# EAGLE schematic Pro Trinket Keyboard V2 (EAGLE 7.1.0)
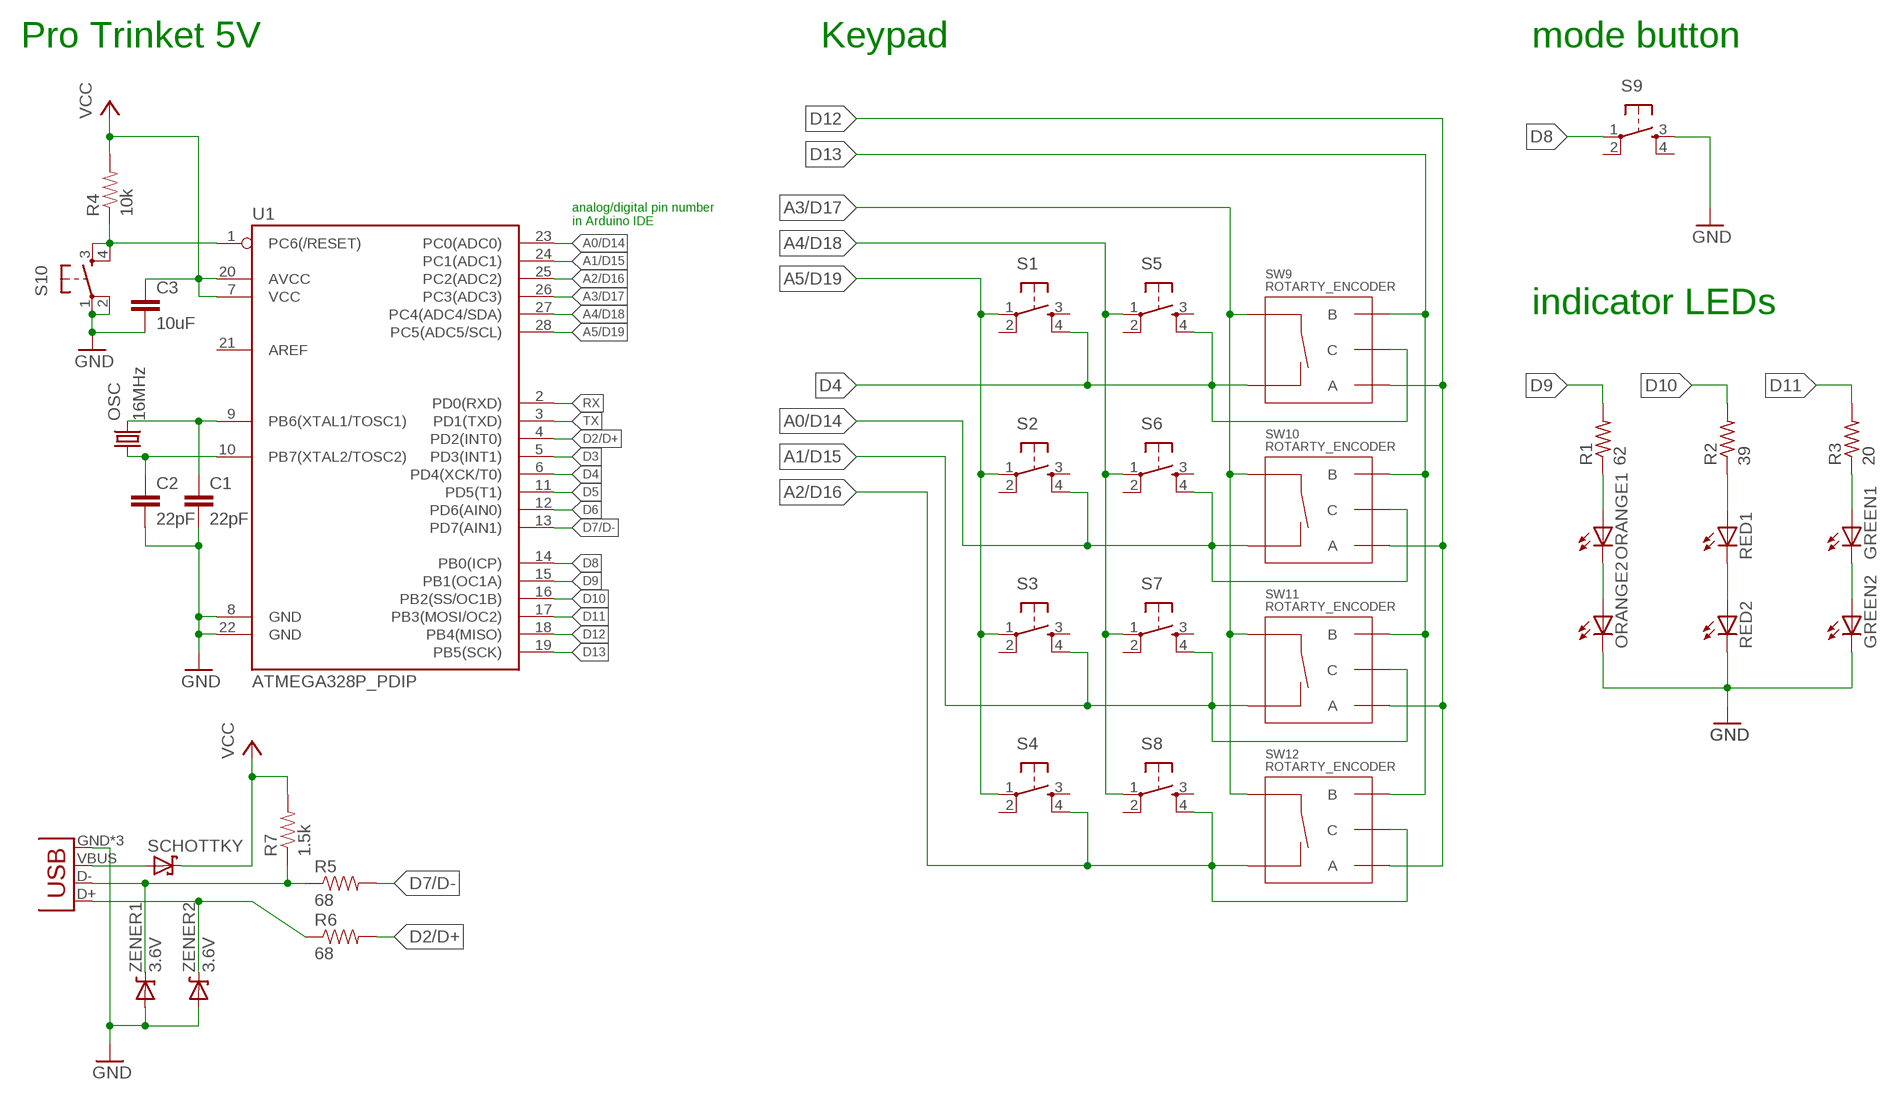
[diagram p0: schematic, sheet 1]

## Parts
C1  22pF  22PF-50V-5%(0603)  [0603-CAP]
C2  22pF  22PF-50V-5%(0603)  [0603-CAP]
C3  10uF  10UF-6.3V-20%(0603)  [0603-CAP]
GREEN1  LED3MM  [LED3MM]
GREEN2  LED3MM  [LED3MM]
JP1  USB-MICROB  [USB-MICROB]
ORANGE1  LED3MM  [LED3MM]
ORANGE2  LED3MM  [LED3MM]
OSC  16MHz  CRYSTALHC49S  [HC49/S]
R1  62  R-US_0204/7  [0204/7]
R2  39  R-US_0204/7  [0204/7]
R3  20  R-US_0204/7  [0204/7]
R4  10k  RESISTOR0805-RES  [0805]
R5  68  RESISTOR0805-RES  [0805]
R6  68  RESISTOR0805-RES  [0805]
R7  1.5k  RESISTOR0805-RES  [0805]
RED1  LED3MM  [LED3MM]
RED2  LED3MM  [LED3MM]
S1  TAC_SWITCHPTH  [TACTILE-PTH]
S2  TAC_SWITCHPTH  [TACTILE-PTH]
S3  TAC_SWITCHPTH  [TACTILE-PTH]
S4  TAC_SWITCHPTH  [TACTILE-PTH]
S5  TAC_SWITCHPTH  [TACTILE-PTH]
S6  TAC_SWITCHPTH  [TACTILE-PTH]
S7  TAC_SWITCHPTH  [TACTILE-PTH]
S8  TAC_SWITCHPTH  [TACTILE-PTH]
S9  TAC_SWITCHPTH  [TACTILE-PTH]
S10  TAC_SWITCHPTH  [TACTILE-PTH]
SCHOTTKY  SCHOTTKY-DIODEAG  [AG]
SW9  ROTARTY_ENCODER  [ROTARY_ENC_PLAIN]
SW10  ROTARTY_ENCODER  [ROTARY_ENC_PLAIN]
SW11  ROTARTY_ENCODER  [ROTARY_ENC_PLAIN]
SW12  ROTARTY_ENCODER  [ROTARY_ENC_PLAIN]
U1  ATMEGA328P_PDIP  [DIL28-3]
ZENER1  3.6V  DIODE-ZENER-BZT52  [SOD-323]
ZENER2  3.6V  DIODE-ZENER-BZT52  [SOD-323]

## Nets
A0/D14: S2.4 S6.4 SW10.C SW10.SW- U1.23(PC0(ADC0))
A1/D15: S3.4 S7.4 SW11.C SW11.SW- U1.24(PC1(ADC1))
A2/D16: S4.4 S8.4 SW12.C SW12.SW- U1.25(PC2(ADC2))
A3/D17: SW9.SW+ SW10.SW+ SW11.SW+ SW12.SW+ U1.26(PC3(ADC3))
A4/D18: S5.1 S6.1 S7.1 S8.1 U1.27(PC4(ADC4/SDA))
A5/D19: S1.1 S2.1 S3.1 S4.1 U1.28(PC5(ADC5/SCL))
D2/D+: R6.2 U1.4(PD2(INT0))
D3: U1.5(PD3(INT1))
D4: S1.4 S5.4 SW9.C SW9.SW- U1.6(PD4(XCK/T0))
D5: U1.11(PD5(T1))
D6: U1.12(PD6(AIN0))
D7/D-: R5.2 U1.13(PD7(AIN1))
D8: S9.1 U1.14(PB0(ICP))
D9: R1.2 U1.15(PB1(OC1A))
D10: R2.2 U1.16(PB2(SS/OC1B))
D11: R3.2 U1.17(PB3(MOSI/OC2))
D12: SW9.A SW10.A SW11.A SW12.A U1.18(PB4(MISO))
D13: SW9.B SW10.B SW11.B SW12.B U1.19(PB5(SCK))
GND: C1.2 C2.2 C3.2 GREEN2.K(C) JP1.GND JP1.MT1(GND) JP1.MT2(GND) ORANGE2.K(C) RED2.K(C) S9.3 S10.1 S10.2 U1.8(GND) U1.22(GND) ZENER1.A ZENER2.A
N$1: ORANGE1.A R1.1
N$2: ORANGE1.K(C) ORANGE2.A
N$3: R2.1 RED1.A
N$4: RED1.K(C) RED2.A
N$5: GREEN1.A R3.1
N$6: GREEN1.K(C) GREEN2.A
N$7: C1.1 OSC.2 U1.9(PB6(XTAL1/TOSC1))
N$8: C2.1 OSC.1 U1.10(PB7(XTAL2/TOSC2))
N$9: R4.1 S10.3 S10.4 U1.1(PC6(/RESET))
N$10: JP1.VBUS SCHOTTKY.A
N$11: JP1.D- R5.1 R7.1 ZENER1.C
N$12: JP1.D+ R6.1 ZENER2.C
RX: U1.2(PD0(RXD))
TX: U1.3(PD1(TXD))
VCC: C3.1 R4.2 R7.2 SCHOTTKY.C U1.7(VCC) U1.20(AVCC)
Unconnected: S1.2 S1.3 S2.2 S2.3 S3.2 S3.3 S4.2 S4.3 S5.2 S5.3 S6.2 S6.3 S7.2 S7.3 S8.2 S8.3 S9.2 S9.4 U1.21(AREF)

## Notes on the sheet
- Pro Trinket 5V | Keypad | mode button
- analog/digital pin number
  in Arduino IDE
- indicator LEDs

## Library data of the parts
C1 C2 = SparkFun-Capacitors:22PF-50V-5%(0603): CAP-07876; PROD_ID: CAP-07876
C3 = SparkFun-Capacitors:10UF-6.3V-20%(0603): CAP-11015; PROD_ID: CAP-11015
GREEN1 GREEN2 ORANGE1 ORANGE2 RED1 RED2 = adafruit:LED: LED OSRAM: - CHIPLED LG R971, LG N971, LY N971, LG Q971, LY Q971, LO R971, LY R971 LH N974, LH R974 LS Q976, LO Q976, LY Q976 LO Q996 - Hyper CHIPLED LW Q18S LB Q993, LB Q99A, LB R99A - SideLED LS A670, LO A670, LY A670, LG A670, LP A670 LB A673, LV A673, LT A673, LW A673 LH A674 LY A675 LS A676, LA A676, LO A676, LY A676, LW A676 LS A679, LY A679, LG A679 - Hyper Micro SIDELED® LS Y876, LA Y876, LO Y876, LY Y876 LT Y87S - SmartLED LW L88C, LW L88S LB L89C, LB L89S, LG L890 LS L89K, LO L89K, LY L89K LS L896, LA L896, LO L896, LY L896 - TOPLED LS T670, LO T670, LY T670, LG T670, LP T670 LSG T670, LSP T670, LSY T670, LOP T670, LYG T670 LG T671, LOG T671, LSG T671 LB T673, LV T673, LT T673, LW T673 LH T674 LS T676, LA T676, LO T676, LY T676, LB T676, LH T676, LSB T676, LW T676 LB T67C, LV T67C, LT T67C, LS T67K, LO T67K, LY T67K, LW E67C LS E67B, LA E67B, LO E67B, LY E67B, LB E67C, LV E67C, LT E67C LW T67C LS T679, LY T679, LG T679 LS T770, LO T770, LY T770, LG T770, LP T770 LB T773, LV T773, LT T773, LW T773 LH T774 LS E675, LA E675, LY E675, LS T675 LS T776, LA T776, LO T776, LY T776, LB T776 LHGB T686 LT T68C, LB T68C - Hyper Mini TOPLED® LB M676 - Mini TOPLED Santana® LG M470 LS M47K, LO M47K, LY M47K Source: http://www.osram.convergy.de/
JP1 = SparkFun-Connectors:USB: USB Connectors USB-B-PTH is fully proven SKU : PRT-00139/CONN-08278 USB-miniB is fully proven SKU : PRT-00587 USB-A-PCB is untested. USB-A-H is throughly reviewed, but untested. Spark Fun Electronics SKU : PRT-00437 USB-B-SMT is throughly reviewed, but untested. Needs silkscreen touching up. USB-A-S has not been used/tested USB-MB-H has not been used/tested USB-MICROB has been used. CONN-09505; PROD_ID: CONN-09505
OSC = adafruit:CRYSTAL: CRYSTAL; OC_FARNELL: 1667008; OC_NEWARK: unknown
R1-R3 = adafruit:R-US_: RESISTOR, American symbol
R4-R7 = SparkFun-Passives:RESISTOR: Resistor Basic schematic elements and footprints for 0603, 1206, and PTH resistors.
S1-S10 = SparkFun-Electromechanical:TAC_SWITCH: Momentary Switch Button commonly used for reset or general input. Spark Fun Electronics SKU : COM-00097 SMT- SWCH-08247
SCHOTTKY = adafruit:SCHOTTKY-DIODE: Schottky Diode
SW9-SW12 = SparkFun-Electromechanical:ROTARTY_ENCODER: Simple no LED rotary encoder Example: COM-09117
U1 = SparkFun-DigitalIC:ATMEGA328P_PDIP: uC used in the Arduino 32kb flash, 1k EEPROM, 2k SRAM This is the through-hole version of this chip.
ZENER1 ZENER2 = SparkFun-DiscreteSemi:DIODE-ZENER: Zener Diode Production Part - 8199 3.4V Zener Voltage